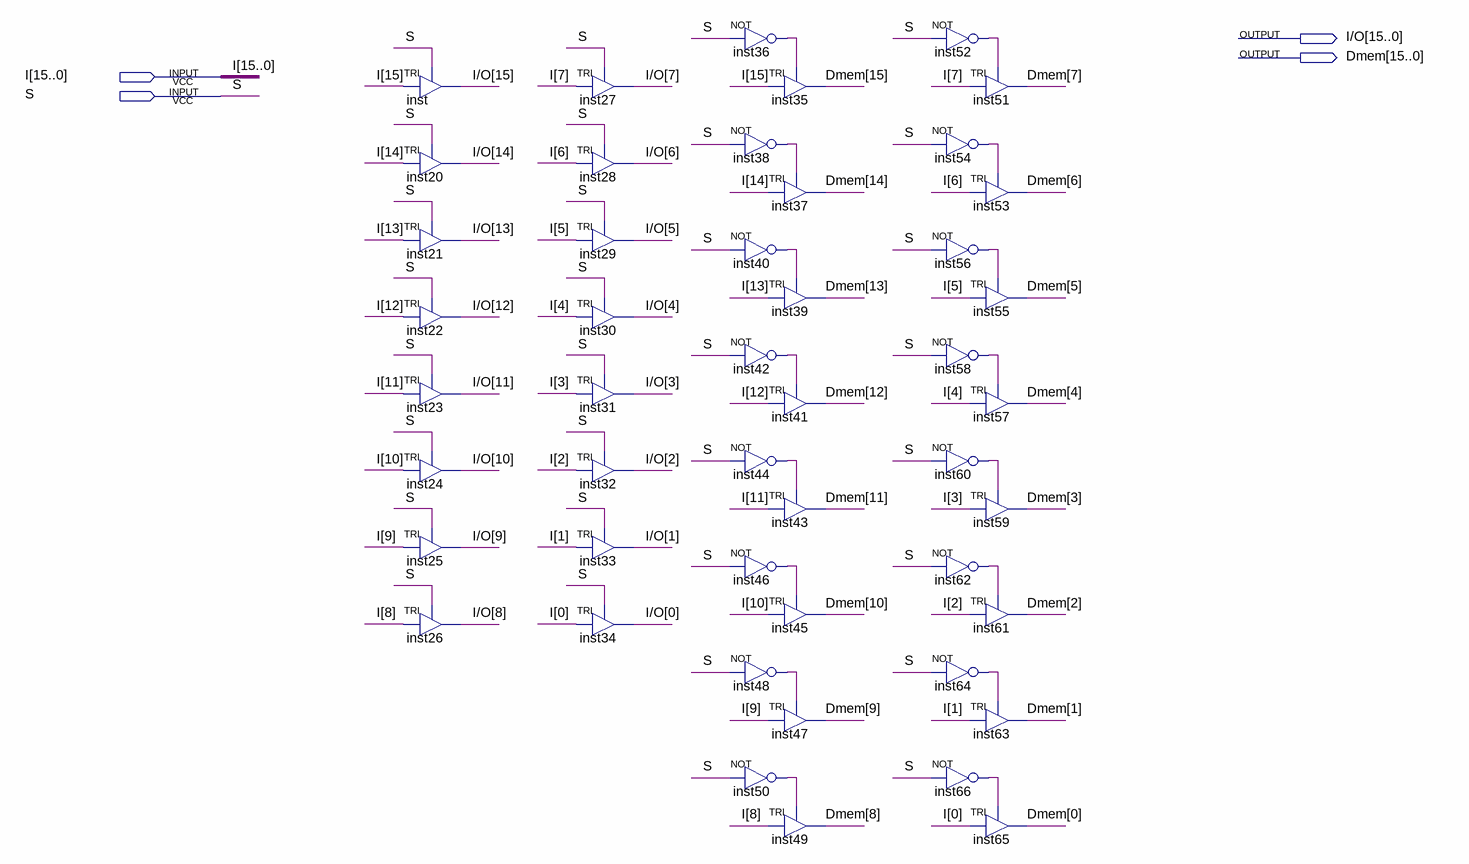
[diagram p0: schematic sheet]
// Quartus schematic MuxIO.bdf as structural Verilog: 48 symbols, 4 pins
module MuxIO (
  input  [15:0] I,
  input  S,
  output [15:0] \I/O ,
  output [15:0] Dmem
);

  wire inst36_out, inst38_out, inst40_out, inst42_out, inst44_out, inst46_out, inst48_out, inst50_out,
       inst52_out, inst54_out, inst56_out, inst58_out, inst60_out, inst62_out, inst64_out, inst66_out;

  TRI inst (.IN(I[15]), .OE(S), .OUT(\I/O [15]));
  TRI inst20 (.IN(I[14]), .OE(S), .OUT(\I/O [14]));
  TRI inst21 (.IN(I[13]), .OE(S), .OUT(\I/O [13]));
  TRI inst22 (.IN(I[12]), .OE(S), .OUT(\I/O [12]));
  TRI inst23 (.IN(I[11]), .OE(S), .OUT(\I/O [11]));
  TRI inst24 (.IN(I[10]), .OE(S), .OUT(\I/O [10]));
  TRI inst25 (.IN(I[9]), .OE(S), .OUT(\I/O [9]));
  TRI inst26 (.IN(I[8]), .OE(S), .OUT(\I/O [8]));
  TRI inst27 (.IN(I[7]), .OE(S), .OUT(\I/O [7]));
  TRI inst28 (.IN(I[6]), .OE(S), .OUT(\I/O [6]));
  TRI inst29 (.IN(I[5]), .OE(S), .OUT(\I/O [5]));
  TRI inst30 (.IN(I[4]), .OE(S), .OUT(\I/O [4]));
  TRI inst31 (.IN(I[3]), .OE(S), .OUT(\I/O [3]));
  TRI inst32 (.IN(I[2]), .OE(S), .OUT(\I/O [2]));
  TRI inst33 (.IN(I[1]), .OE(S), .OUT(\I/O [1]));
  TRI inst34 (.IN(I[0]), .OE(S), .OUT(\I/O [0]));
  not inst36 (inst36_out, S);
  TRI inst35 (.IN(I[15]), .OE(inst36_out), .OUT(Dmem[15]));
  not inst38 (inst38_out, S);
  TRI inst37 (.IN(I[14]), .OE(inst38_out), .OUT(Dmem[14]));
  not inst40 (inst40_out, S);
  TRI inst39 (.IN(I[13]), .OE(inst40_out), .OUT(Dmem[13]));
  not inst42 (inst42_out, S);
  TRI inst41 (.IN(I[12]), .OE(inst42_out), .OUT(Dmem[12]));
  not inst44 (inst44_out, S);
  TRI inst43 (.IN(I[11]), .OE(inst44_out), .OUT(Dmem[11]));
  not inst46 (inst46_out, S);
  TRI inst45 (.IN(I[10]), .OE(inst46_out), .OUT(Dmem[10]));
  not inst48 (inst48_out, S);
  TRI inst47 (.IN(I[9]), .OE(inst48_out), .OUT(Dmem[9]));
  not inst50 (inst50_out, S);
  TRI inst49 (.IN(I[8]), .OE(inst50_out), .OUT(Dmem[8]));
  not inst52 (inst52_out, S);
  not inst54 (inst54_out, S);
  not inst56 (inst56_out, S);
  not inst58 (inst58_out, S);
  not inst60 (inst60_out, S);
  not inst62 (inst62_out, S);
  not inst64 (inst64_out, S);
  not inst66 (inst66_out, S);
  TRI inst51 (.IN(I[7]), .OE(inst52_out), .OUT(Dmem[7]));
  TRI inst53 (.IN(I[6]), .OE(inst54_out), .OUT(Dmem[6]));
  TRI inst55 (.IN(I[5]), .OE(inst56_out), .OUT(Dmem[5]));
  TRI inst57 (.IN(I[4]), .OE(inst58_out), .OUT(Dmem[4]));
  TRI inst59 (.IN(I[3]), .OE(inst60_out), .OUT(Dmem[3]));
  TRI inst61 (.IN(I[2]), .OE(inst62_out), .OUT(Dmem[2]));
  TRI inst63 (.IN(I[1]), .OE(inst64_out), .OUT(Dmem[1]));
  TRI inst65 (.IN(I[0]), .OE(inst66_out), .OUT(Dmem[0]));
endmodule
